# Altium project OLED.PrjPcb
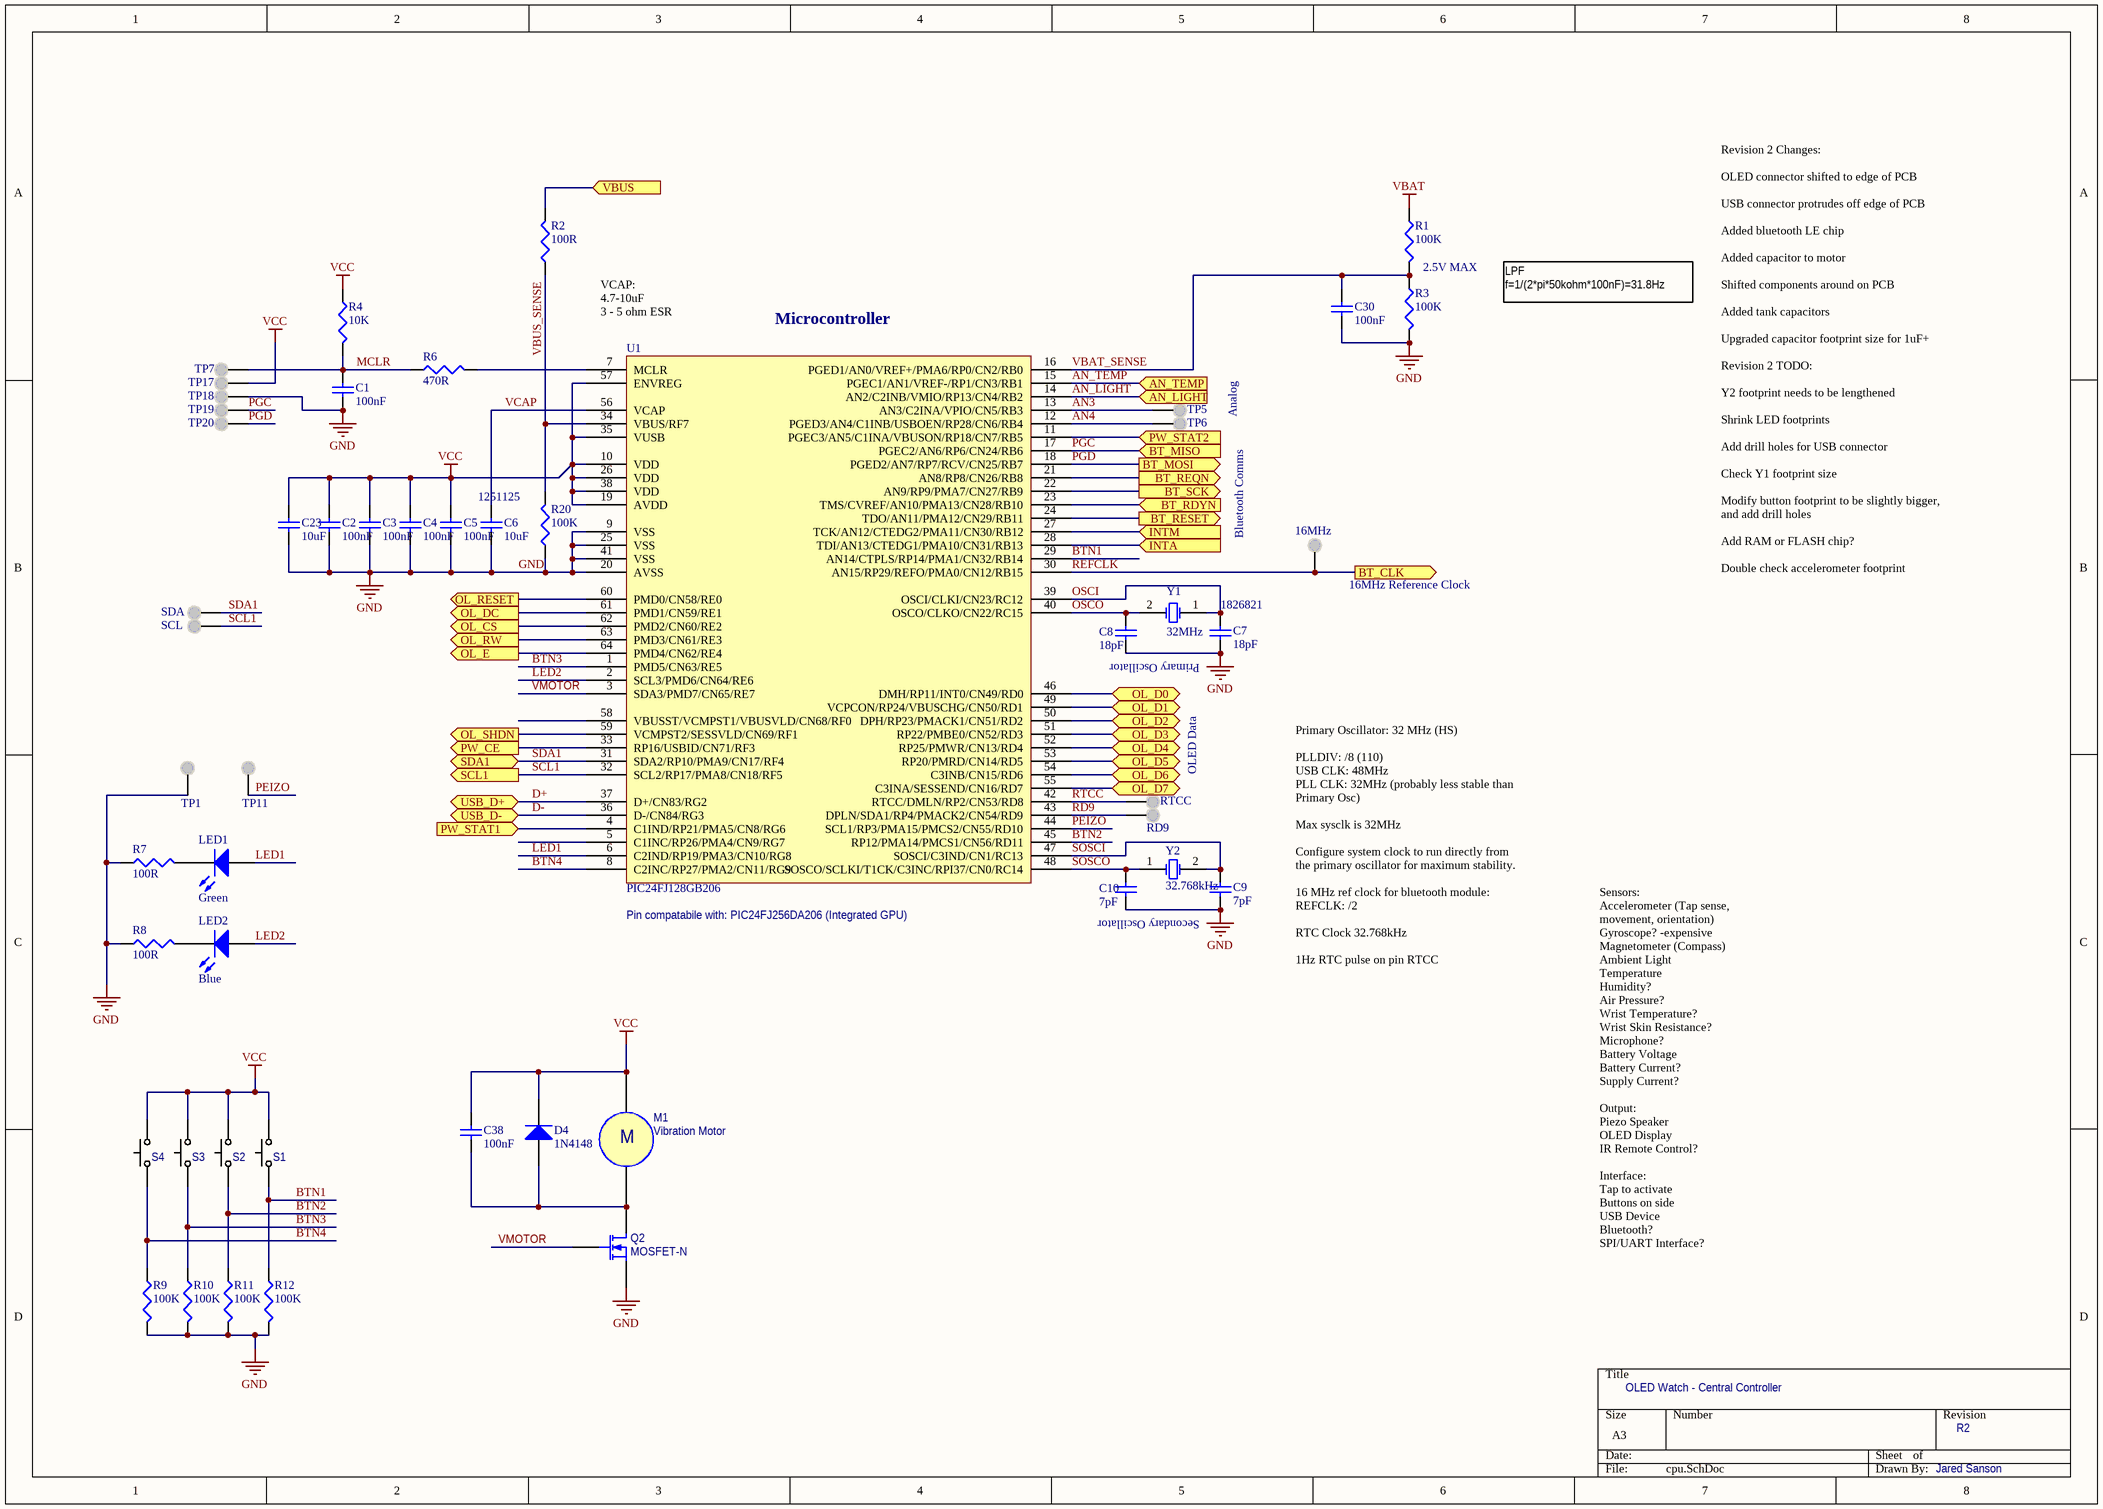
[diagram p0: cpu.SchDoc]
5 sheets, 119 parts. Net scope: flat (ports and power ports of the same name join across sheets).
Board file: pcb.PcbDoc
Sheets:
  cpu.SchDoc
  power.SchDoc
  oled.SchDoc
  sensors.SchDoc
  bluetoothle.SchDoc

## Sheet cpu.SchDoc
size A3

### Parts
C1  value 100nF  [0603C]  (hidden comment: Cap)
C2  value 100nF  [0603C]  (hidden comment: Cap)
C3  value 100nF  [0603C]  (hidden comment: Cap)
C4  value 100nF  [0603C]  (hidden comment: Cap)
C5  value 100nF  [0603C]  (hidden comment: Cap)
C6  value 10uF  Supplier Part Number 1: 1251125  [0805C]  (hidden comment: Cap)
C7  value 18pF  [0603C]  (hidden comment: Cap)
C8  value 18pF  [0603C]  (hidden comment: Cap)
C9  value 7pF  [0603C]  (hidden comment: Cap)
C10  value 7pF  [0603C]  (hidden comment: Cap)
C23  value 10uF  [0805C]  (hidden comment: Cap)
C30  value 100nF  [0603C]  (hidden comment: Cap)
C38  value 100nF  [0603C]  (hidden comment: Cap)
D4  1N4148  [0603D]
LED1  Green  [0603LED]
LED2  Blue  [0603LED]
M1  Vibration Motor  [VIBRATION_MOTOR]
OSC  16MHz  [TESTPOINT_TOP]
Q2  MOSFET-N  [SOT-23B_N]
R1  value 100K  [0603R]  (hidden comment: Res3)
R2  value 100R  [0603R]  (hidden comment: Res3)
R3  value 100K  [0603R]  (hidden comment: Res3)
R4  value 10K  [0603R]  (hidden comment: Res3)
R6  value 470R  [0603R]  (hidden comment: Res3)
R7  value 100R  [0603R]  (hidden comment: Res3)
R8  value 100R  [0603R]  (hidden comment: Res3)
R9  value 100K  [0603R]  (hidden comment: Res3)
R10  value 100K  [0603R]  (hidden comment: Res3)
R11  value 100K  [0603R]  (hidden comment: Res3)
R12  value 100K  [0603R]  (hidden comment: Res3)
R20  value 100K  [0603R]  (hidden comment: Res3)
RD9  (no value)  [TESTPOINT_TOP]
RTCC  RTCC  [TESTPOINT_TOP]  (value not drawn)
S1  SideButton  [SIDE_BUTTON]  (value not drawn)
S2  SideButton  [SIDE_BUTTON]  (value not drawn)
S3  SideButton  [SIDE_BUTTON]  (value not drawn)
S4  SideButton  [SIDE_BUTTON]  (value not drawn)
SCL  SCL  [TESTPOINT_TOP]  (value not drawn)
SDA  SDA  [TESTPOINT_TOP]  (value not drawn)
TP1  PZ-  [TESTPOINT_TOP]  (value not drawn)
TP5  AN4  [TESTPOINT_TOP]  (value not drawn)
TP6  AN5  [TESTPOINT_TOP]  (value not drawn)
TP7  MCLR  [TESTPOINT_TOP]  (value not drawn)
TP11  PZ+  [TESTPOINT_TOP]  (value not drawn)
TP17  VCC  [TESTPOINT_TOP]  (value not drawn)
TP18  GND  [TESTPOINT_TOP]  (value not drawn)
TP19  PGC  [TESTPOINT_TOP]  (value not drawn)
TP20  PGD  [TESTPOINT_TOP]  (value not drawn)
U1  PIC24FJ128GB206  [TQFP_64_10MM]
Y1  32MHz  Supplier Part Number 1: 1826821  [ABRACON32MHZ]
Y2  32.768kHz  [BCY-W2/D1.5]

### Ports
AN_LIGHT (in), AN_TEMP (in), BT_CLK (out), BT_MISO (in), BT_MOSI (out), BT_RDYN (in), BT_REQN (out), BT_RESET (out), BT_SCK (out), INTA (in), INTM (in), OL_CS (out), OL_D0 (bidir), OL_D1 (bidir), OL_D2 (bidir), OL_D3 (bidir), OL_D4 (bidir), OL_D5 (bidir), OL_D6 (bidir), OL_D7 (bidir), OL_DC (out), OL_E (out), OL_RESET (out), OL_RW (out), OL_SHDN (out), PW_CE (out), PW_STAT1 (in), PW_STAT2 (in), SCL1 (out), SDA1 (bidir), USB_D+ (bidir), USB_D- (bidir), VBUS (in)

### Nets
GND: C1.2 C2.2 C3.2 C4.2 C5.2 C6.2 C7.2 C8.2 C9.2 C10.2 C23.2 C30.2 Q2.3(S) R3.2 R7.1 R8.1 R9.2 R10.2 R11.2 R12.2 R20.1 TP1.1(TP) TP18.1(TP) U1.9(VSS) U1.20(AVSS) U1.25(VSS) U1.41(VSS)
VBAT: R1.1
VCC: C2.1 C3.1 C4.1 C5.1 C23.1 C38.1 D4.2(K) M1.1 R4.1 S1.2 S2.2 S3.2 S4.2 TP17.1(TP) U1.10(VDD) U1.19(AVDD) U1.26(VDD) U1.35(VUSB) U1.38(VDD) U1.57(ENVREG)
AN3: TP5.1(TP) U1.13(AN3/C2INA/VPIO/CN5/RB3)
AN4: TP6.1(TP) U1.12(PGED3/AN4/C1INB/USBOEN/RP28/CN6/RB4)
AN_LIGHT: U1.14(AN2/C2INB/VMIO/RP13/CN4/RB2) ; port AN_LIGHT
AN_TEMP: U1.15(PGEC1/AN1/VREF-/RP1/CN3/RB1) ; port AN_TEMP
BT_RDYN: U1.23(TMS/CVREF/AN10/PMA13/CN28/RB10) ; port BT_RDYN
BT_REQN: U1.21(AN8/RP8/CN26/RB8) ; port BT_REQN
BTN1: R12.1 S1.1 U1.29(AN14/CTPLS/RP14/PMA1/CN32/RB14)
BTN2: R11.1 S2.1 U1.45(RP12/PMA14/PMCS1/CN56/RD11)
BTN3: R10.1 S3.1 U1.1(PMD5/CN63/RE5)
BTN4: R9.1 S4.1 U1.8(C2INC/RP27/PMA2/CN11/RG9)
D+: U1.37(D+/CN83/RG2) ; port USB_D+
D-: U1.36(D-/CN84/RG3) ; port USB_D-
INTA: U1.28(TDI/AN13/CTEDG1/PMA10/CN31/RB13) ; port INTA
INTM: U1.27(TCK/AN12/CTEDG2/PMA11/CN30/RB12) ; port INTM
LED1: LED1.1(A) U1.6(C2IND/RP19/PMA3/CN10/RG8)
LED2: LED2.1(A) U1.2(SCL3/PMD6/CN64/RE6)
MCLR: C1.1 R4.2 R6.1 TP7.1(TP)
OL_CS: U1.62(PMD2/CN60/RE2) ; port OL_CS
OL_D0: U1.46(DMH/RP11/INT0/CN49/RD0) ; port OL_D0
OL_D1: U1.49(VCPCON/RP24/VBUSCHG/CN50/RD1) ; port OL_D1
OL_D2: U1.50(DPH/RP23/PMACK1/CN51/RD2) ; port OL_D2
OL_D3: U1.51(RP22/PMBE0/CN52/RD3) ; port OL_D3
OL_D4: U1.52(RP25/PMWR/CN13/RD4) ; port OL_D4
OL_D5: U1.53(RP20/PMRD/CN14/RD5) ; port OL_D5
OL_D6: U1.54(C3INB/CN15/RD6) ; port OL_D6
OL_D7: U1.55(C3INA/SESSEND/CN16/RD7) ; port OL_D7
OL_DC: U1.61(PMD1/CN59/RE1) ; port OL_DC
OL_E: U1.64(PMD4/CN62/RE4) ; port OL_E
OL_RESET: U1.60(PMD0/CN58/RE0) ; port OL_RESET
OL_RW: U1.63(PMD3/CN61/RE3) ; port OL_RW
OL_SHDN: U1.59(VCMPST2/SESSVLD/CN69/RF1) ; port OL_SHDN
OSCI: C7.1 U1.39(OSCI/CLKI/CN23/RC12) Y1.1(OSC1)
OSCO: C8.1 U1.40(OSCO/CLKO/CN22/RC15) Y1.2(OSC2)
PEIZO: TP11.1(TP) U1.44(SCL1/RP3/PMA15/PMCS2/CN55/RD10)
PGC: TP19.1(TP) U1.17(PGEC2/AN6/RP6/CN24/RB6) ; port BT_MISO
PGD: TP20.1(TP) U1.18(PGED2/AN7/RP7/RCV/CN25/RB7) ; port BT_MOSI
PW_CE: U1.33(RP16/USBID/CN71/RF3) ; port PW_CE
RD9: RD9.1(TP) U1.43(DPLN/SDA1/RP4/PMACK2/CN54/RD9)
REFCLK: OSC.1(TP) U1.30(AN15/RP29/REFO/PMA0/CN12/RB15) ; port BT_CLK
RESET: U1.24(TDO/AN11/PMA12/CN29/RB11) ; port BT_RESET
RTCC: RTCC.1(TP) U1.42(RTCC/DMLN/RP2/CN53/RD8)
SCK: U1.22(AN9/RP9/PMA7/CN27/RB9) ; port BT_SCK
SCL1: SCL.1(TP) U1.32(SCL2/RP17/PMA8/CN18/RF5) ; port SCL1
SDA1: SDA.1(TP) U1.31(SDA2/RP10/PMA9/CN17/RF4) ; port SDA1
SOSCI: C9.1 U1.47(SOSCI/C3IND/CN1/RC13) Y2.2(OSC2)
SOSCO: C10.1 U1.48(SOSCO/SCLKI/T1CK/C3INC/RPI37/CN0/RC14) Y2.1(OSC1)
STAT1: U1.4(C1IND/RP21/PMA5/CN8/RG6) ; port PW_STAT1
STAT2: U1.11(PGEC3/AN5/C1INA/VBUSON/RP18/CN7/RB5) ; port PW_STAT2
VBAT_SENSE: C30.1 R1.2 R3.1 U1.16(PGED1/AN0/VREF+/PMA6/RP0/CN2/RB0)
VBUS: R2.2 ; port VBUS
VBUS_SENSE: R2.1 R20.2 U1.34(VBUS/RF7)
VCAP: C6.1 U1.56(VCAP)
VMOTOR: Q2.2(G) U1.3(SDA3/PMD7/CN65/RE7)
NetC38_2: C38.2 D4.1(A) M1.2 Q2.1(D)
NetLED1_2: LED1.2(K) R7.2
NetLED2_2: LED2.2(K) R8.2
NetR6_2: R6.2 U1.7(MCLR)

Not connected (* = marked no-connect by the designer): U1 5(C1INC/RP26/PMA4/CN9/RG7) 58(VBUSST/VCMPST1/VBUSVLD/CN68/RF0)

### Notes on the sheet
- 2.5V MAX
- LPF
  f=1/(2*pi*50kohm*100nF)=31.8Hz
- VCAP:
  4.7-10uF
  3 - 5 ohm ESR
- (near U1) Microcontroller
- Analog
- Bluetooth Comms
- (near OSC) 16MHz Reference Clock
- Primary Oscillator
- OLED Data
- Revision 2 Changes:
  OLED connector shifted to edge of PCB
  USB connector protrudes off edge of PCB
  Added bluetooth LE chip
  Added capacitor to motor
  Shifted components around on PCB
  Added tank capacitors
  Upgraded capacitor footprint size for 1uF+
  Revision 2 TODO:
  Y2 footprint needs to be lengthened
  Shrink LED footprints
  Add drill holes for USB connector
  Check Y1 footprint size
  Modify button footprint to be slightly bigger, and add drill holes
  Add RAM or FLASH chip?
  Double check accelerometer footprint
- (near U1) Pin compatabile with: PIC24FJ256DA206 (Integrated GPU)
- Secondary Oscillator
- Primary Oscillator: 32 MHz (HS)
  PLLDIV: /8 (110)
  USB CLK: 48MHz
  PLL CLK: 32MHz (probably less stable than Primary Osc)
  Max sysclk is 32MHz
  Configure system clock to run directly from the primary oscillator for maximum stability.
  16 MHz ref clock for bluetooth module:
  REFCLK: /2
  RTC Clock 32.768kHz
  1Hz RTC pulse on pin RTCC
- Sensors:
  Accelerometer (Tap sense, movement, orientation)
  Gyroscope? -expensive
  Magnetometer (Compass)
  Ambient Light
  Temperature
  Humidity?
  Air Pressure?
  Wrist Temperature?
  Wrist Skin Resistance?
  Microphone?
  Battery Voltage
  Battery Current?
  Supply Current?
  Output:
  Piezo Speaker
  OLED Display
  IR Remote Control?
  Interface:
  Tap to activate
  Buttons on side
  USB Device
  Bluetooth?
  SPI/UART Interface?
- OLED Watch - Central Controller
- R2
- Jared Sanson
- (in symbol VibrationMotor) M

### Library data of the parts
C1-C10 C23 C30 C38 = Cap: Capacitor; Published: 8-Jun-2000; LatestRevisionDate: 17-Jul-2002; LatestRevisionNote: Re-released for DXP Platform.; PackageReference: RAD-0.3; Publisher: Altium Limited; PackageDescription: Radial Cap, Thru-Hole; 2 Leads; 0.3 in Pin Spacing
  C6: Supplier 1: Farnell
D4 = Diode: Default Diode; Published: 8-Jun-2000; LatestRevisionDate: 17-Jul-2002; LatestRevisionNote: Re-released for DXP Platform.; PackageVersion: Sep-1996; PackageReference: SMC; Publisher: Altium Limited; PackageDescription: DO-214-AB/SMC; 2 C-Bend Leads; Body 7.9 x 5.9 mm, inc. leads (LxW); Code_JEDEC: DO-214-AB
LED1 LED2 = LED2: Typical RED, GREEN, YELLOW, AMBER GaAs LED; Published: 8-Jun-2000; LatestRevisionDate: 17-Jul-2002; LatestRevisionNote: Re-released for DXP Platform.; PackageVersion: Feb-2002; PackageReference: 3.2X1.6X1.1; Publisher: Altium Limited; PackageDescription: SM LED; 2 Flat Leads
M1 = VibrationMotor
OSC RD9 RTCC SCL SDA TP1 TP5-TP7 TP11 TP17-TP20 = TestPoint: Test Point; Comment_1: *
Q2 = MOSFET-N: N-Channel MOSFET; Published: 8-Jun-2000; LatestRevisionDate: 17-Jul-2002; LatestRevisionNote: Re-released for DXP Platform.; PackageVersion: 1995/1996; PackageReference: E3; Publisher: Altium Limited; PackageDescription: TO, Flat Index; 3 In-Line, Axial Leads; Body Dia. 4.6mm; Lead Dia. 0.5 mm (max)
R1-R4 R6-R12 R20 = Res3: Resistor; Published: 8-Jun-2000; LatestRevisionDate: 29-May-2009; LatestRevisionNote: IPC-7351 Footprint Added.; PackageReference: J1-0603; Publisher: Altium Limited; PackageDescription: Chip Resistor
Y1 = XTAL: Crystal Oscillator; Manufacturer: ABRACON; Manufacturer Part Number: ABM3-32.000MHZ-D2Y-T; Description: ABRACON - ABM3-32.000MHZ-D2Y-T - CRYSTAL, 32MHZ, 18PF, SMD; Published: 8-Jun-2000; LatestRevisionDate: 17-Jul-2002; LatestRevisionNote: Re-released for DXP Platform.; PackageReference: R38; Publisher: Altium Limited; PackageDescription: Crystal, Thru-Hole; 2 Leads; Body 3.1 x 8.2 mm (Dia.xH); Supplier 1: Farnell; RoHS: Y-EX; Stock 1: 728; Pricing 1: 1=2.88, 10=2.25, 50=1.75, 100=1.26, 500=1.02 (NZD); ComponentLink1URL: http://www.abracon.com/Resonators/abm3.pdf; ComponentLink1Description: http://www.abracon.com/Resonators/abm3.pdf
Y2 = XTAL: Crystal Oscillator; Published: 8-Jun-2000; LatestRevisionDate: 17-Jul-2002; LatestRevisionNote: Re-released for DXP Platform.; PackageReference: R38; Publisher: Altium Limited; PackageDescription: Crystal, Thru-Hole; 2 Leads; Body 3.1 x 8.2 mm (Dia.xH)

## Sheet power.SchDoc
size A4
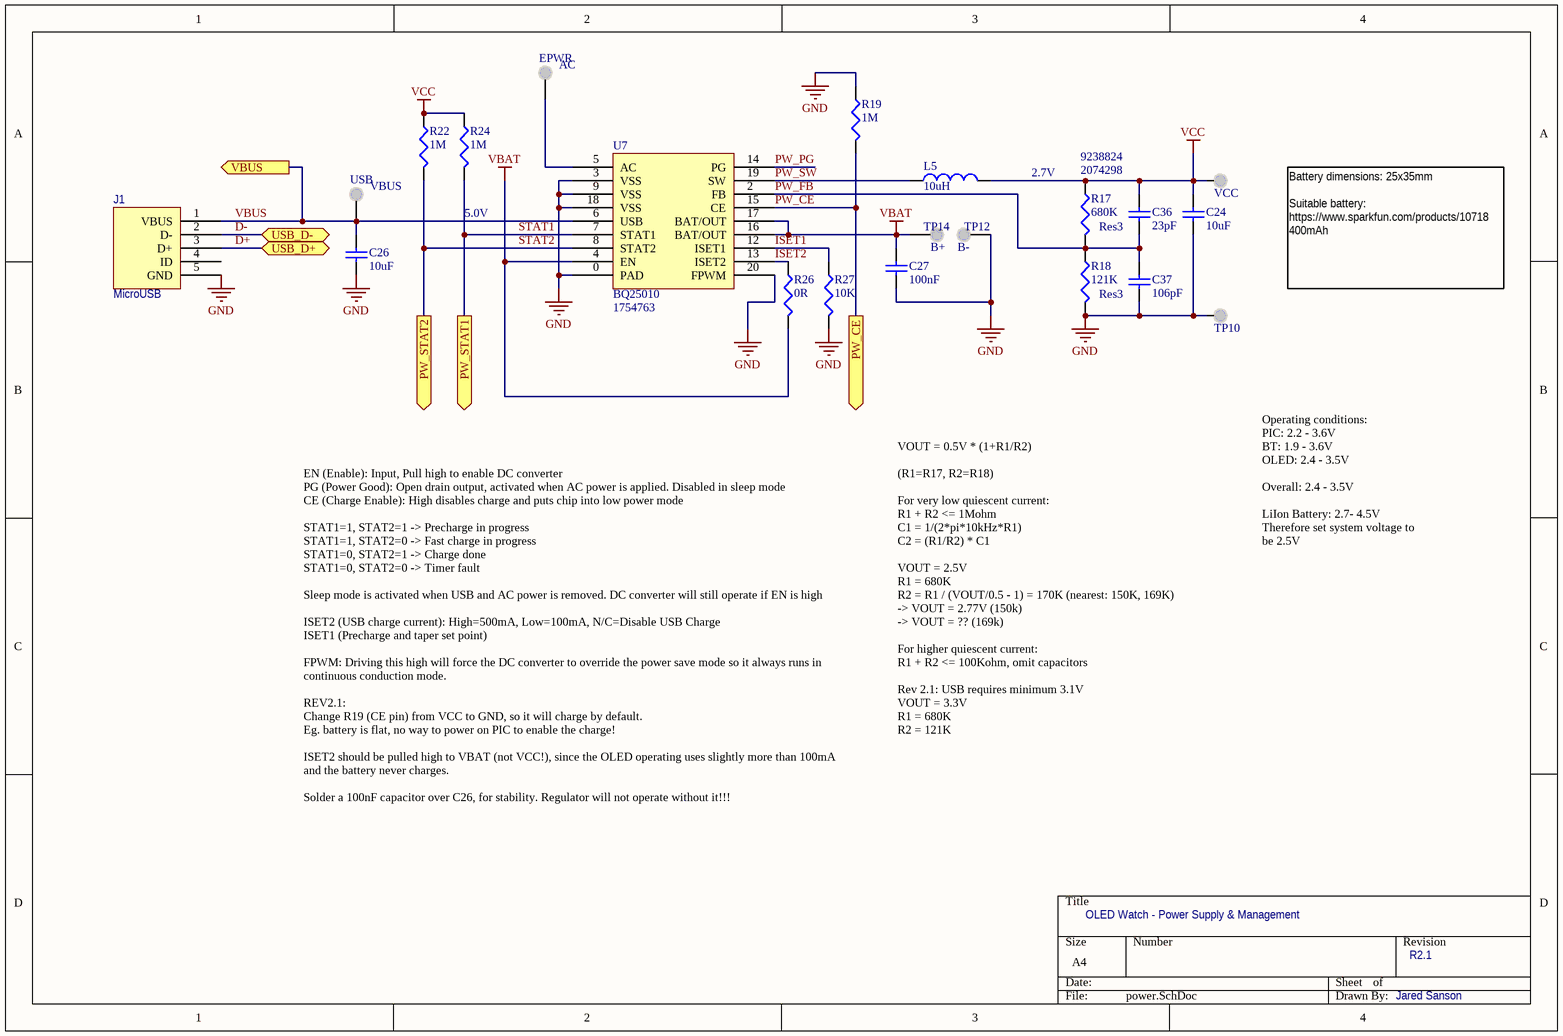
[diagram p1: power.SchDoc]

### Parts
C24  value 10uF  [0805C]  (hidden comment: Cap)
C26  value 10uF  [0805C]  (hidden comment: Cap)
C27  value 100nF  [0603C]  (hidden comment: Cap)
C36  value 23pF  [0603C]  (hidden comment: Cap)
C37  value 106pF  [0603C]  (hidden comment: Cap)
EPWR  AC  [TESTPOINT_TOP]
J1  MicroUSB  [MICRO_USB]
L5  value 10uH  [INDC3225N]  (hidden comment: Inductor)
R17  Res3  value 680K  Supplier Part Number 1: 2074298  Supplier Part Number 2: 9238824  [0603R]
R18  Res3  value 121K  [0603R]
R19  value 1M  [0603R]  (hidden comment: Res3)
R22  value 1M  [0603R]  (hidden comment: Res3)
R24  value 1M  [0603R]  (hidden comment: Res3)
R26  value 0R  [0603R]  (hidden comment: Res3)
R27  value 10K  [0603R]  (hidden comment: Res3)
TP10  GND  [TESTPOINT_TOP]  (value not drawn)
TP12  B-  [TESTPOINT_TOP]
TP14  B+  [TESTPOINT_TOP]
U7  BQ25010  Supplier Part Number 1: 1754763  [RHL]
USB  VBUS  [TESTPOINT_TOP]
VCC  VCC  [TESTPOINT_TOP]  (value not drawn)

### Ports
PW_CE (out), PW_STAT1 (out), PW_STAT2 (out), USB_D+ (bidir), USB_D- (bidir), VBUS (out)

### Nets
GND: C24.2 C26.2 C27.2 C37.2 J1.5(GND) R18.2 R19.1 R27.2 TP10.1(TP) TP12.1(TP) U7.0(PAD) U7.3(VSS) U7.9(VSS) U7.18(VSS) U7.20(FPWM)
VBAT: C27.1 R26.2 TP14.1(TP) U7.4(EN) U7.16(BAT/OUT) U7.17(BAT/OUT)
VCC: C24.1 C36.1 L5.2 R17.1 R22.1 R24.1 VCC.1(TP)
D+: J1.3(D+) ; port USB_D+
D-: J1.2(D-) ; port USB_D-
ISET1: R27.1 U7.12(ISET1)
ISET2: R26.1 U7.13(ISET2)
PW_CE: R19.2 U7.15(CE) ; port PW_CE
PW_FB: C36.2 C37.1 R17.2 R18.1 U7.2(FB)
PW_PG: U7.14(PG)
PW_SW: L5.1 U7.19(SW)
STAT1: R24.2 U7.7(STAT1) ; port PW_STAT1
STAT2: R22.2 U7.8(STAT2) ; port PW_STAT2
VBUS: C26.1 J1.1(VBUS) U7.6(USB) USB.1(TP) ; port VBUS
NetEPWR_1: EPWR.1(TP) U7.5(AC)

Not connected (* = marked no-connect by the designer): J1 4(ID)

### Notes on the sheet
- (near R17) 2.7V
- 5.0V
- Battery dimensions: 25x35mm
  Suitable battery:
  https://www.sparkfun.com/products/10718
  400mAh
- Operating conditions:
  PIC: 2.2 - 3.6V
  BT: 1.9 - 3.6V
  OLED: 2.4 - 3.5V
  Overall: 2.4 - 3.5V
  LiIon Battery: 2.7- 4.5V
  Therefore set system voltage to be 2.5V
- VOUT = 0.5V * (1+R1/R2)
  (R1=R17, R2=R18)
  For very low quiescent current:
  R1 + R2 <= 1Mohm
  C1 = 1/(2*pi*10kHz*R1)
  C2 = (R1/R2) * C1
  VOUT = 2.5V
  R1 = 680K
  R2 = R1 / (VOUT/0.5 - 1) = 170K (nearest: 150K, 169K)
  -> VOUT = 2.77V (150k)
  -> VOUT = ?? (169k)
  For higher quiescent current:
  R1 + R2 <= 100Kohm, omit capacitors
  Rev 2.1: USB requires minimum 3.1V
  VOUT = 3.3V
  R1 = 680K
  R2 = 121K
- EN (Enable): Input, Pull high to enable DC converter
  PG (Power Good): Open drain output, activated when AC power is applied. Disabled in sleep mode
  CE (Charge Enable): High disables charge and puts chip into low power mode
  STAT1=1, STAT2=1 -> Precharge in progress
  STAT1=1, STAT2=0 -> Fast charge in progress
  STAT1=0, STAT2=1 -> Charge done
  STAT1=0, STAT2=0 -> Timer fault
  Sleep mode is activated when USB and AC power is removed. DC converter will still operate if EN is high
  ISET2 (USB charge current): High=500mA, Low=100mA, N/C=Disable USB Charge
  ISET1 (Precharge and taper set point)
  FPWM: Driving this high will force the DC converter to override the power save mode so it always runs in continuous conduction mode.
  REV2.1:
  Change R19 (CE pin) from VCC to GND, so it will charge by default.
  Eg. battery is flat, no way to power on PIC to enable the charge!
  ISET2 should be pulled high to VBAT (not VCC!), since the OLED operating uses slightly more than 100mA and the battery never charges.
  Solder a 100nF capacitor over C26, for stability. Regulator will not operate without it!!!
- OLED Watch - Power Supply & Management
- R2.1
- Jared Sanson

### Library data of the parts
C24 C26 C27 C36 C37 = Cap: Capacitor; Published: 8-Jun-2000; LatestRevisionDate: 17-Jul-2002; LatestRevisionNote: Re-released for DXP Platform.; PackageReference: RAD-0.3; Publisher: Altium Limited; PackageDescription: Radial Cap, Thru-Hole; 2 Leads; 0.3 in Pin Spacing
EPWR TP10 TP12 TP14 USB VCC = TestPoint: Test Point; Comment_1: *
L5 = Inductor: Code_IEC: 1005; Published: 8-Jun-2000; LatestRevisionDate: 29-May-2009; LatestRevisionNote: IPC-7351 Footprint Added.; PackageReference: 0402-A; Publisher: Altium Limited; PackageDescription: Chip Inductor; Code_JEITA: 0402
R17-R19 R22 R24 R26 R27 = Res3: Resistor; Published: 8-Jun-2000; LatestRevisionDate: 29-May-2009; LatestRevisionNote: IPC-7351 Footprint Added.; PackageReference: J1-0603; Publisher: Altium Limited; PackageDescription: Chip Resistor
  R17 R18: Supplier 1: Farnell; Supplier 2: Farnell
U7 = BQ25010: Supplier 1: Farnell

## Sheet oled.SchDoc
size A4
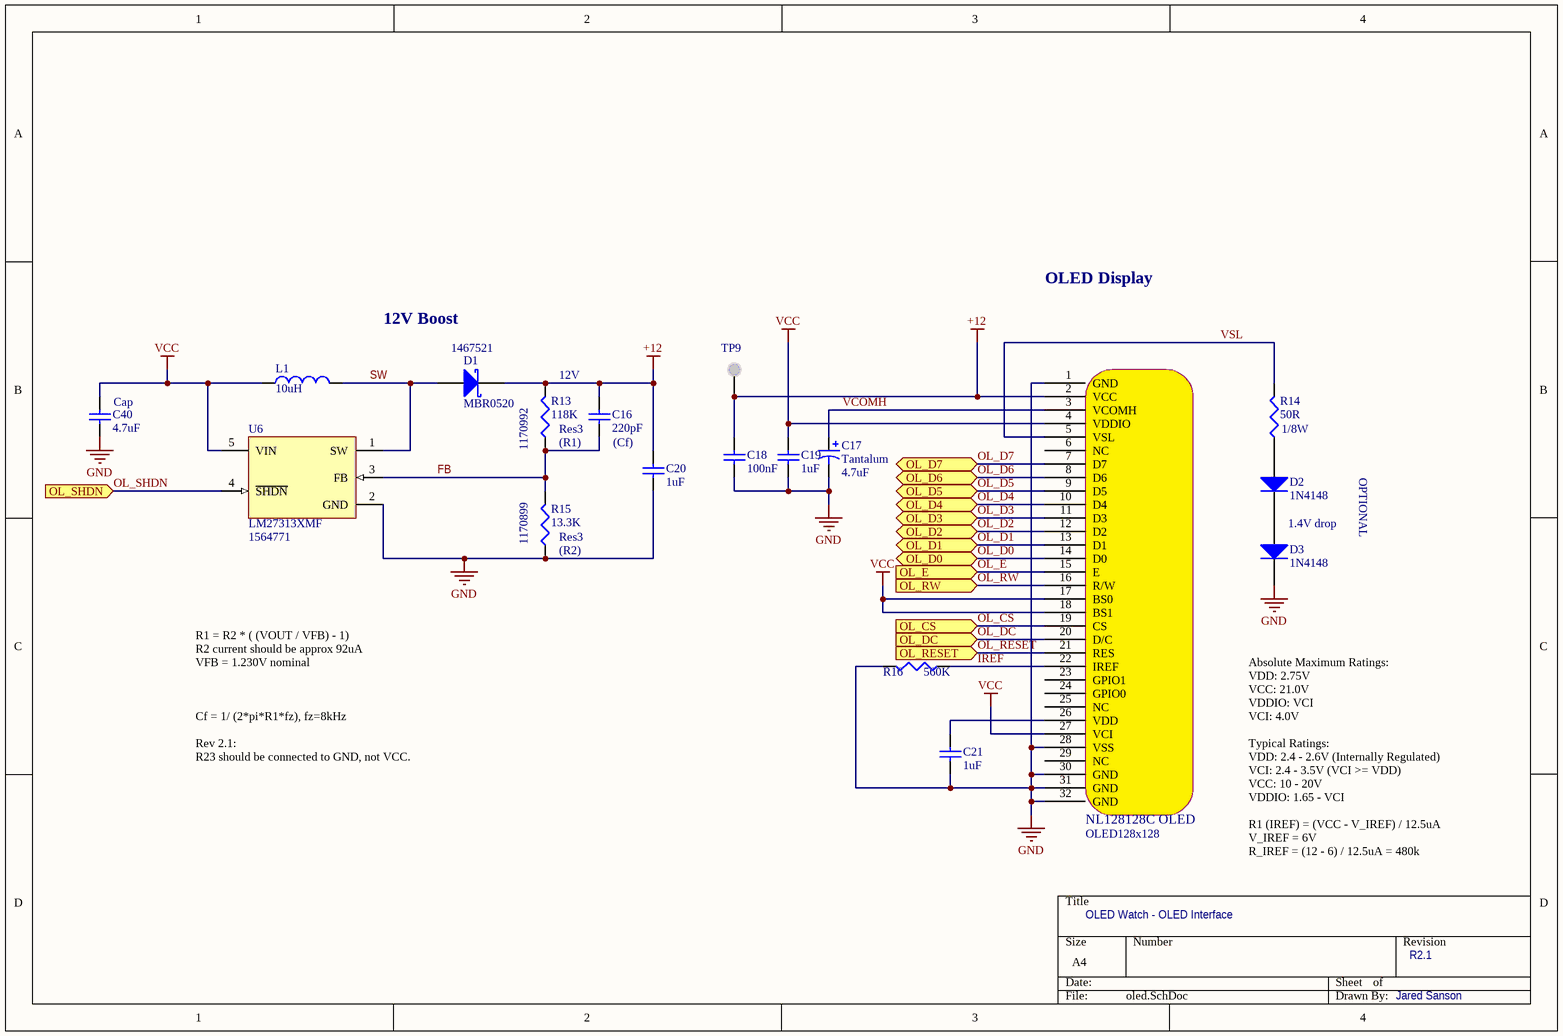
[diagram p2: oled.SchDoc]

### Parts
C16  value 220pF  Variable: (Cf)  [0603C]  (hidden comment: Cap)
C17  Tantalum  value 4.7uF  [0805C]
C18  value 100nF  [0603C]  (hidden comment: Cap)
C19  value 1uF  [0603C]  (hidden comment: Cap)
C20  value 1uF  [0805C]  (hidden comment: Cap)
C21  value 1uF  [0805C]  (hidden comment: Cap)
C40  Cap  value 4.7uF  [0805C]
D1  MBR0520  Supplier Part Number 1: 1467521  [0603D]
D2  1N4148  [0603D]
D3  1N4148  [0603D]
L1  value 10uH  [INDC3225N]  (hidden comment: Inductor)
OLED128x128  OLED128x128  [OLED128X128]  (value not drawn)
R13  Res3  value 118K  Variable: (R1)  Supplier Part Number 1: 1170992  [0603R]
R14  value 50R  [0603R]  (hidden comment: Res3)
R15  Res3  value 13.3K  Variable: (R2)  Supplier Part Number 1: 1170899  [0603R]
R16  value 560K  [0603R]  (hidden comment: Res3)
TP9  +12  [TESTPOINT_TOP]  (value not drawn)
U6  LM27313XMF  Supplier Part Number 1: 1564771  [MF05A_N]

### Ports
OL_CS (in), OL_D0 (bidir), OL_D1 (bidir), OL_D2 (bidir), OL_D3 (bidir), OL_D4 (bidir), OL_D5 (bidir), OL_D6 (bidir), OL_D7 (bidir), OL_DC (in), OL_E (in), OL_RESET (in), OL_RW (in), OL_SHDN (in)

### Nets
+12: C16.1 C18.1 C20.1 D1.2(K) OLED128x128.2(VCC) R13.2 TP9.1(TP)
GND: C17.2 C18.2 C19.2 C20.2 C21.2 C40.2 D3.2(K) OLED128x128.1(GND) OLED128x128.28(VSS) OLED128x128.30(GND) OLED128x128.31(GND) OLED128x128.32(GND) R15.1 R16.2 U6.2(GND)
VCC: C19.1 C40.1 L1.1 OLED128x128.4(VDDIO) OLED128x128.17(BS0) OLED128x128.18(BS1) OLED128x128.27(VCI) U6.5(VIN)
FB: C16.2 R13.1 R15.2 U6.3(FB)
IREF: OLED128x128.22(IREF) R16.1
OL_CS: OLED128x128.19(CS) ; port OL_CS
OL_D0: OLED128x128.14(D0) ; port OL_D0
OL_D1: OLED128x128.13(D1) ; port OL_D1
OL_D2: OLED128x128.12(D2) ; port OL_D2
OL_D3: OLED128x128.11(D3) ; port OL_D3
OL_D4: OLED128x128.10(D4) ; port OL_D4
OL_D5: OLED128x128.9(D5) ; port OL_D5
OL_D6: OLED128x128.8(D6) ; port OL_D6
OL_D7: OLED128x128.7(D7) ; port OL_D7
OL_DC: OLED128x128.20(D/C) ; port OL_DC
OL_E: OLED128x128.15(E) ; port OL_E
OL_RESET: OLED128x128.21(RES) ; port OL_RESET
OL_RW: OLED128x128.16(R/W) ; port OL_RW
OL_SHDN: U6.4(~{SHDN}) ; port OL_SHDN
SW: D1.1(A) L1.2 U6.1(SW)
VCOMH: C17.1 OLED128x128.3(VCOMH)
VSL: OLED128x128.5(VSL) R14.2
NetC21_1: C21.1 OLED128x128.26(VDD)
NetD2_1: D2.1(A) R14.1
NetD2_2: D2.2(K) D3.1(A)

Not connected (* = marked no-connect by the designer): OLED128x128 6(NC) 23(GPIO1) 24(GPIO0) 25(NC) 29(NC)

### Notes on the sheet
- OLED Display
- 12V Boost
- (near R13) 12V
- (near R14) 1/8W
- OPTIONAL
- 1.4V drop
- R1 = R2 * ( (VOUT / VFB) - 1)
  R2 current should be approx 92uA
  VFB = 1.230V nominal
  Cf = 1/ (2*pi*R1*fz), fz=8kHz
  Rev 2.1:
  R23 should be connected to GND, not VCC.
- OLED Watch - OLED Interface
- Absolute Maximum Ratings:
  VDD: 2.75V
  VCC: 21.0V
  VDDIO: VCI
  VCI: 4.0V
  Typical Ratings:
  VDD: 2.4 - 2.6V (Internally Regulated)
  VCI: 2.4 - 3.5V (VCI >= VDD)
  VCC: 10 - 20V
  VDDIO: 1.65 - VCI
  R1 (IREF) = (VCC - V_IREF) / 12.5uA
  V_IREF = 6V
  R_IREF = (12 - 6) / 12.5uA = 480k
- R2.1
- Jared Sanson
- (in symbol O) NL128128C OLED

### Library data of the parts
C16 C18-C21 C40 = Cap: Capacitor; Published: 8-Jun-2000; LatestRevisionDate: 17-Jul-2002; LatestRevisionNote: Re-released for DXP Platform.; PackageReference: RAD-0.3; Publisher: Altium Limited; PackageDescription: Radial Cap, Thru-Hole; 2 Leads; 0.3 in Pin Spacing
C17 = Cap Pol1: Polarized Capacitor (Radial); Published: 8-Jun-2000; LatestRevisionDate: 17-Jul-2002; LatestRevisionNote: Re-released for DXP Platform.; PackageReference: RB7.6-15; Publisher: Altium Limited; PackageDescription: Polarized Capacitor (Radial); 2 Leads
D1 = D Schottky: Schottky Diode; Published: 8-Jun-2000; LatestRevisionDate: 17-Jul-2002; LatestRevisionNote: Re-released for DXP Platform.; PackageReference: SMB; Publisher: Altium Limited; PackageDescription: DO-214-AA/SMB; 2 C-Bend Leads; Body 5.3 x 3.6 mm, inc. leads (LxW); Code_JEDEC: DO-214-AA; Supplier 1: Farnell
D2 D3 = Diode: Default Diode; Published: 8-Jun-2000; LatestRevisionDate: 17-Jul-2002; LatestRevisionNote: Re-released for DXP Platform.; PackageVersion: Sep-1996; PackageReference: SMC; Publisher: Altium Limited; PackageDescription: DO-214-AB/SMC; 2 C-Bend Leads; Body 7.9 x 5.9 mm, inc. leads (LxW); Code_JEDEC: DO-214-AB
L1 = Inductor: Code_IEC: 1005; Published: 8-Jun-2000; LatestRevisionDate: 29-May-2009; LatestRevisionNote: IPC-7351 Footprint Added.; PackageReference: 0402-A; Publisher: Altium Limited; PackageDescription: Chip Inductor; Code_JEITA: 0402
OLED128x128 = O: OLED
R13-R16 = Res3: Resistor; Published: 8-Jun-2000; LatestRevisionDate: 29-May-2009; LatestRevisionNote: IPC-7351 Footprint Added.; PackageReference: J1-0603; Publisher: Altium Limited; PackageDescription: Chip Resistor
  R13 R15: Supplier 1: Farnell
TP9 = TestPoint: Test Point; Comment_1: *
U6 = LM27313XMF: 1.6 MHz Boost Converter With 30V Internal FET Switch in SOT-23; Manufacturer: National Semiconductor; CompType: Switcher; PackageTopMarking: SRPB*XTT; PowerWise: N; FirstPublished: 4-Dec-2008; DatasheetVersion: Jul-2007; PackageVersion: revD, Aug-2008; PackageReference: MF05A; Publisher: Altium Limited; PackageDescription: Molded SOT-23, .115 x .063 x .040 in Body, 5 Lead, .0375 in Pitch; PartNumber: LM27313XMF; RoHS: O; PinCount: 5; DigiKeyPartNumber: LM27313XMFCT-ND; ComponentLink1Description: LM27313 Datasheet; ComponentLink1URL: http://www.national.com/ds/LM/LM27313.pdf; ComponentLink2Description: LM27313 Web Page; ComponentLink2URL: http://www.national.com/pf/LM/LM27313.html; ComponentLink3Description: MF05A Package Page; ComponentLink3URL: http://www.national.com/packaging/folders/mf05a.html; Supplier 1: Farnell

## Sheet sensors.SchDoc
size A4
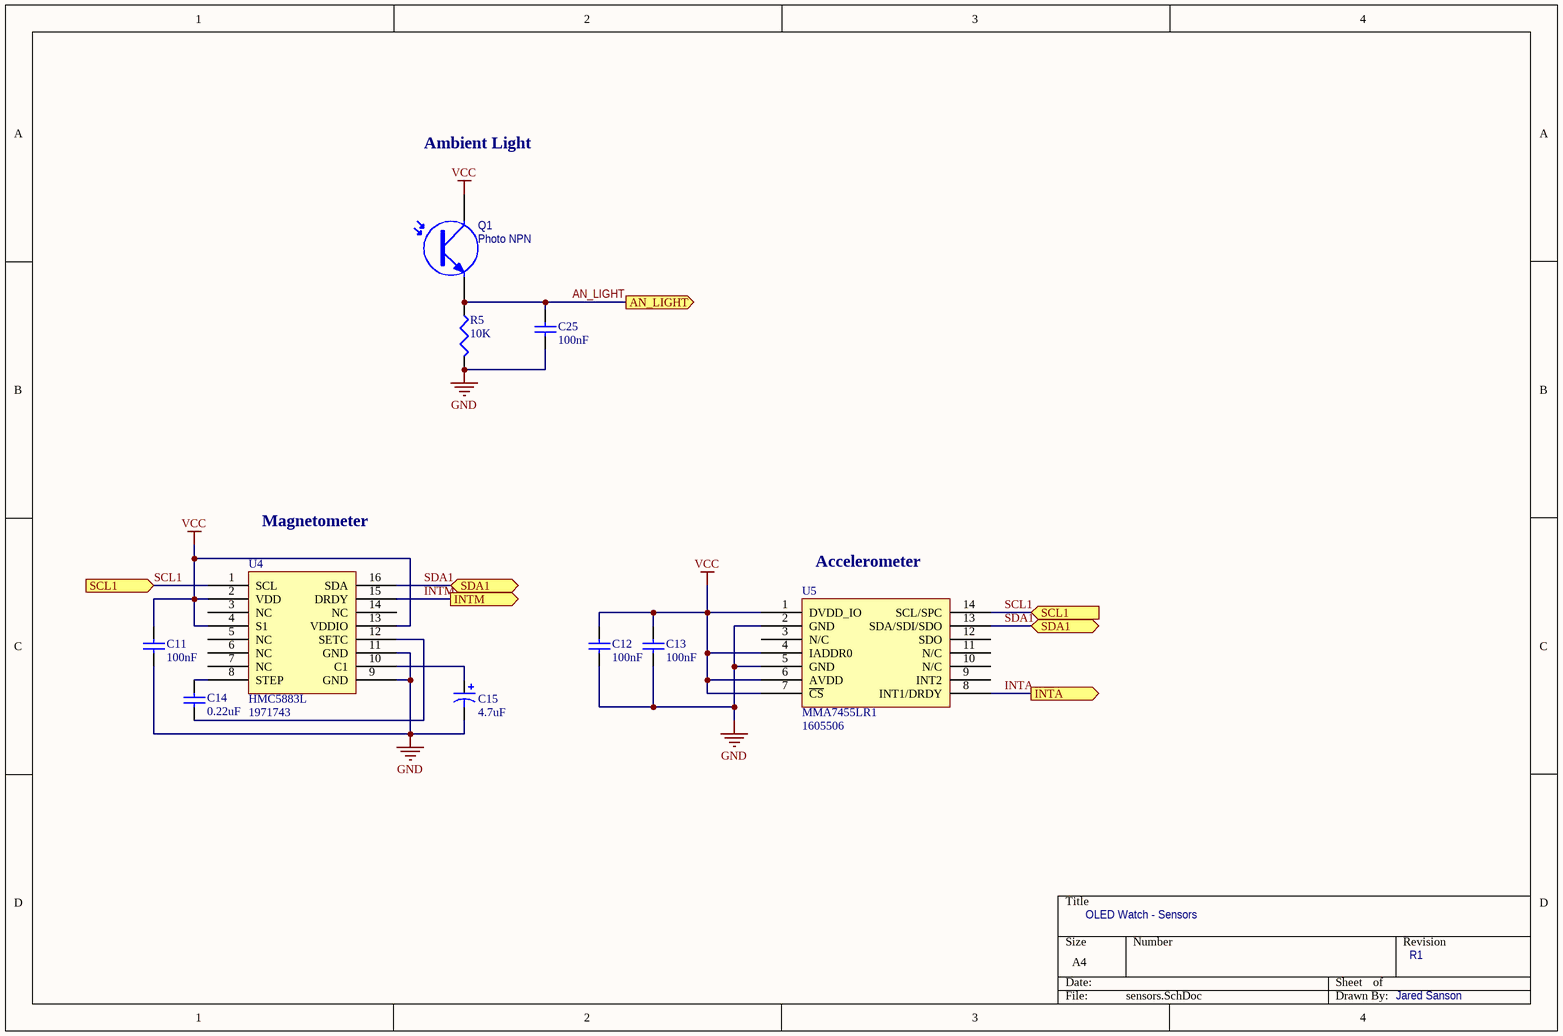
[diagram p3: sensors.SchDoc]

### Parts
C11  value 100nF  [0603C]  (hidden comment: Cap)
C12  value 100nF  [0603C]  (hidden comment: Cap)
C13  value 100nF  [0603C]  (hidden comment: Cap)
C14  value 0.22uF  [0603C]  (hidden comment: Cap)
C15  value 4.7uF  [0805C]  (hidden comment: Cap Pol1)
C25  value 100nF  [0603C]  (hidden comment: Cap)
Q1  Photo NPN  [TEMT6000]
R5  value 10K  [0603R]  (hidden comment: Res3)
U4  HMC5883L  Supplier Part Number 1: 1971743  [HMC5883L_16PINQFN]
U5  MMA7455LR1  Supplier Part Number 1: 1605506  [LGA80P500X300-14N]

### Ports
AN_LIGHT (out), INTA (out), INTM (out), SCL1 (in), SDA1 (bidir)

### Nets
GND: C11.2 C12.2 C13.2 C15.2 C25.2 R5.2 U4.9(GND) U4.11(GND) U5.2(GND) U5.5(GND)
VCC: C11.1 C12.1 C13.1 Q1.1(C) U4.2(VDD) U4.4(S1) U4.13(VDDIO) U5.1(DVDD_IO) U5.4(IADDR0) U5.6(AVDD) U5.7(~{CS})
AN_LIGHT: C25.1 Q1.3(E) R5.1 ; port AN_LIGHT
INTA: U5.8(INT1/DRDY) ; port INTA
INTM: U4.15(DRDY) ; port INTM
SCL1: U4.1(SCL) U5.14(SCL/SPC) ; port SCL1
SDA1: U4.16(SDA) U5.13(SDA/SDI/SDO) ; port SDA1
NetC14_1: C14.1 U4.12(SETC)
NetC14_2: C14.2 U4.8(STEP)
NetC15_1: C15.1 U4.10(C1)

Not connected (* = marked no-connect by the designer): U4 3(NC) 5(NC) 6(NC) 7(NC) 14(NC); U5 3(N/C) 9(INT2) 10(N/C) 11(N/C) 12(SDO)

### Notes on the sheet
- Ambient Light
- Magnetometer
- (near U5) Accelerometer
- OLED Watch - Sensors
- R1
- Jared Sanson

### Library data of the parts
C11-C14 C25 = Cap: Capacitor; Published: 8-Jun-2000; LatestRevisionDate: 17-Jul-2002; LatestRevisionNote: Re-released for DXP Platform.; PackageReference: RAD-0.3; Publisher: Altium Limited; PackageDescription: Radial Cap, Thru-Hole; 2 Leads; 0.3 in Pin Spacing
C15 = Cap Pol1: Polarized Capacitor (Radial); Published: 8-Jun-2000; LatestRevisionDate: 17-Jul-2002; LatestRevisionNote: Re-released for DXP Platform.; PackageReference: RB7.6-15; Publisher: Altium Limited; PackageDescription: Polarized Capacitor (Radial); 2 Leads
Q1 = Photo NPN: NPN Phototransistor; Published: 24-Mar-1999; LatestRevisionDate: 17-Jul-2002; LatestRevisionNote: Re-released for DXP Platform.; PackageReference: TO-220_A; Publisher: Altium Limited; Code_JEDEC: TO-220-AC
R5 = Res3: Resistor; Published: 8-Jun-2000; LatestRevisionDate: 29-May-2009; LatestRevisionNote: IPC-7351 Footprint Added.; PackageReference: J1-0603; Publisher: Altium Limited; PackageDescription: Chip Resistor
U4 = HMC5883L: Honeywell 3 Axis Magnetometer; Manufacturer: HONEYWELL M&PS; Manufacturer Part Number: HMC5883L-TR; Description: HONEYWELL M&PS - HMC5883L-TR - SENSOR, MAGNETIC, 3AXIS, 16 PIN; Magnetic Field Min: -8; Magnetic Field Max: 8; Resolution (Gauss): 0.005; Interface Type: I2; Magnetometer Range: -8G to 8; Supply Voltage Range: 2.16V DC to 3.6; Supplier 1: Farnell; RoHS: YES; Stock 1: 526; Pricing 1: 1=3.61, 5=3.43, 10=3.28, 25=3.09 (NZD); Operating Temperature Max: 85; Operating Temperature Min: -30; Operating Temperature Range: -30°C to +85; ComponentLink1URL: http://www.farnell.com/datasheets/1683374.pdf; ComponentLink1Description: http://www.farnell.com/datasheets/1683374.pdf
U5 = MMA7455LR1: 3-Axis Accelerometer, 5g; Manufacturer: FREESCALE SEMICONDUCTOR; Description: FREESCALE SEMICONDUCTOR - MMA7455LR1 - IC, 3-AXIS DIGITAL 2, 4, 8G, 14-LGA; MEMS Sensor Output: Digital; Measurement Axis: X, Y, Z; Acceleration Range: ± 2g, ± 4g, ± 8; Supply Voltage Min: 2.4; Supply Voltage Max: 3.6; Sensor Case Style: LGA; No. of Pins: 14; Sensitivity Min: 58counts/g, 29counts/g, 14.5; Sensitivity Typ: 16counts/g, 32counts/g, 64; Sensitivity Max: 70counts/g, 35counts/g, 17.5; SVHC: No SVHC (19-Dec-2012); Amplifier Type: Accelerometer Sensor X-Y-Z axis; Interface Type: I2; No. of Bits: 10; No. of Channels: 3; Supply Current: 400; Supply Voltage Range: 2.4V to 3.6; Supplier 1: Farnell; Manufacturer Part Number: MMA7455LR1; RoHS: YES; Stock 1: 19; Pricing 1: 1=4.24, 25=4.19, 100=4.11, 1000=3.67 (NZD); MSL: MSL 3 - 168 hours; Operating Temperature Max: 85; Operating Temperature Min: -40; Operating Temperature Range: -40°C to +85; Package / Case: LGA; Supply Voltage DC Max: 3.6; Supply Voltage DC Min: 2.4; Termination Type: SMD; ComponentLink1URL: http://www.freescale.com/files/sensors/doc/data_sheet/MMA7455L.pdf; ComponentLink1Description: http://www.freescale.com/files/sensors/doc/data_sheet/MMA7455L.pdf

## Sheet bluetoothle.SchDoc
size A4
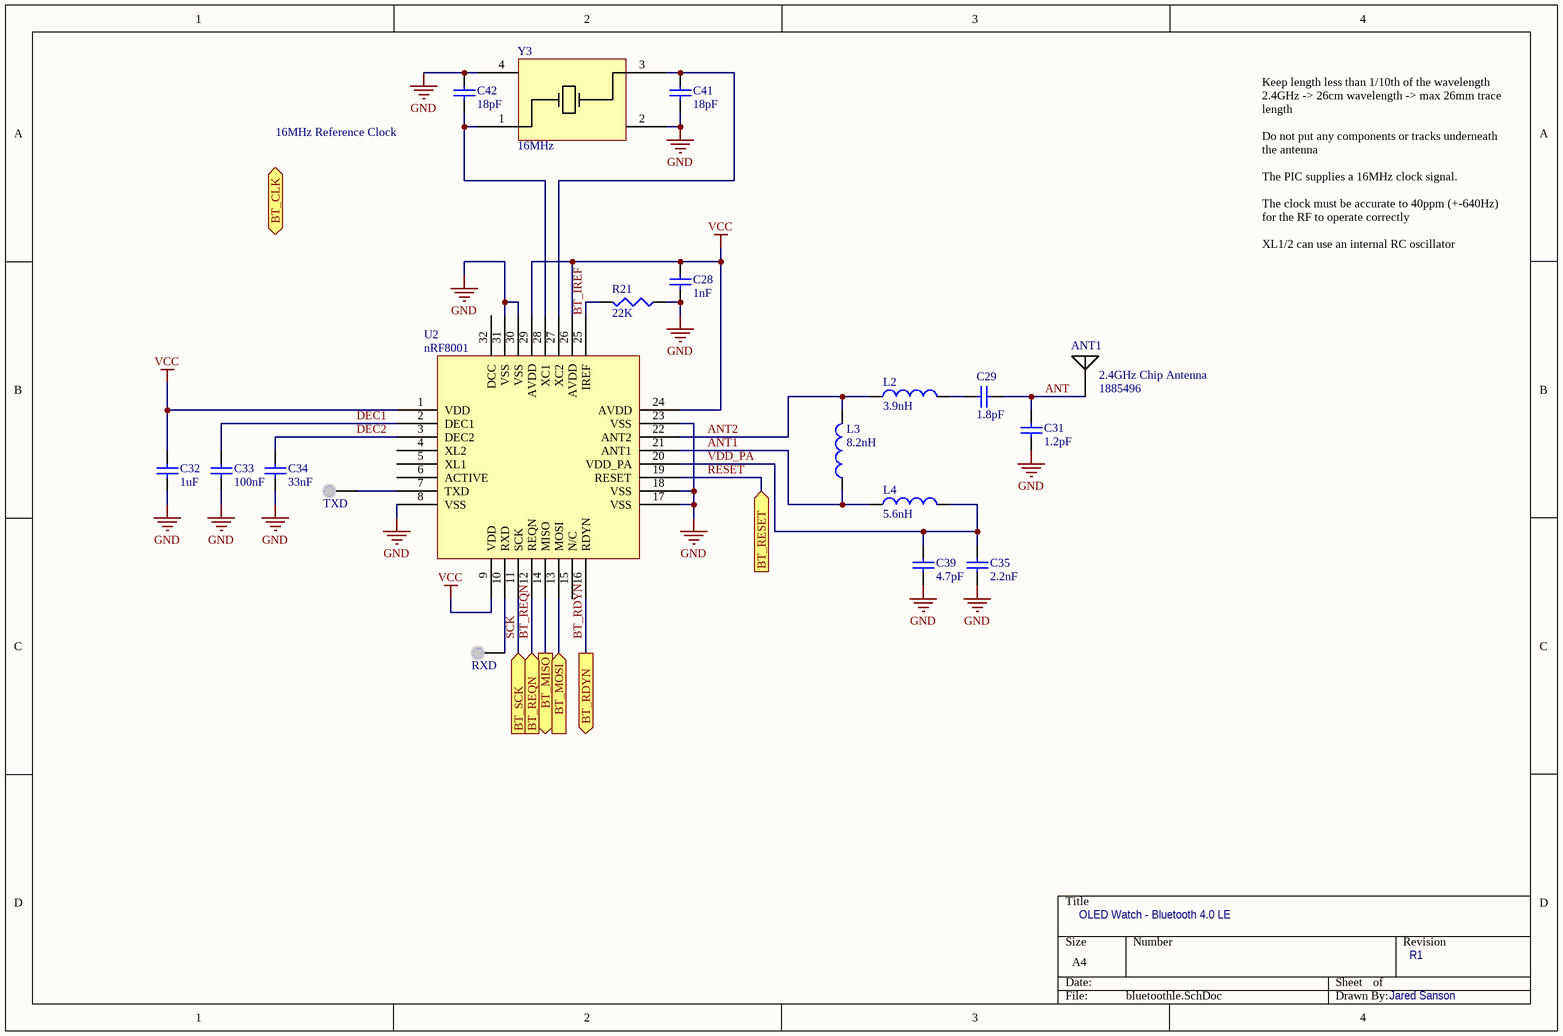
[diagram p4: bluetoothle.SchDoc]

### Parts
ANT1  2.4GHz Chip Antenna  Supplier Part Number 1: 1885496  [2450AT18A100E]
C28  value 1nF  [0603C]  (hidden comment: Cap)
C29  value 1.8pF  [0603C]  (hidden comment: Cap)
C31  value 1.2pF  [0603C]  (hidden comment: Cap)
C32  value 1uF  [0805C]  (hidden comment: Cap)
C33  value 100nF  [0603C]  (hidden comment: Cap)
C34  value 33nF  [0603C]  (hidden comment: Cap)
C35  value 2.2nF  [0603C]  (hidden comment: Cap)
C39  value 4.7pF  [0603C]  (hidden comment: Cap)
C41  value 18pF  [0603C]  (hidden comment: Cap)
C42  value 18pF  [0603C]  (hidden comment: Cap)
L2  value 3.9nH  [0603L]  (hidden comment: Inductor)
L3  value 8.2nH  [0603L]  (hidden comment: Inductor)
L4  value 5.6nH  [0603L]  (hidden comment: Inductor)
R21  value 22K  [0603R]  (hidden comment: Res3)
RXD  AN4  [TESTPOINT_TOP]  (value not drawn)
TXD  AN4  [TESTPOINT_TOP]  (value not drawn)
U2  nRF8001  [QFN50P500X500-32V5N]
Y3  value 16MHz  [TXC-16MHZ]  (hidden comment: TXC-16MHz)

### Ports
BT_CLK (in), BT_MISO (out), BT_MOSI (in), BT_RDYN (out), BT_REQN (in), BT_RESET (in), BT_SCK (in)

### Nets
GND: C28.1 C31.1 C32.2 C33.2 C34.2 C35.2 C39.2 C41.1 C42.2 R21.1 U2.8(VSS) U2.17(VSS) U2.18(VSS) U2.23(VSS) U2.30(VSS) U2.31(VSS) Y3.2 Y3.4
VCC: C28.2 C32.1 U2.1(VDD) U2.9(VDD) U2.24(AVDD) U2.26(AVDD) U2.29(AVDD)
ANT: ANT1.1 C29.2 C31.2
ANT1: L3.1 L4.1 U2.21(ANT1)
ANT2: L2.1 L3.2 U2.22(ANT2)
BT_IREF: R21.2 U2.25(IREF)
BT_RDYN: U2.16(RDYN) ; port BT_RDYN
BT_REQN: U2.12(REQN) ; port BT_REQN
DEC1: C33.1 U2.2(DEC1)
DEC2: C34.1 U2.3(DEC2)
PGC: U2.14(MISO) ; port BT_MISO
PGD: U2.13(MOSI) ; port BT_MOSI
RESET: U2.19(RESET) ; port BT_RESET
SCK: U2.11(SCK) ; port BT_SCK
VDD_PA: C35.1 C39.1 L4.2 U2.20(VDD_PA)
NetC29_1: C29.1 L2.2
NetC41_2: C41.2 U2.27(XC2) Y3.3
NetC42_1: C42.1 U2.28(XC1) Y3.1
NetRXD_1: RXD.1(TP) U2.10(RXD)
NetTXD_1: TXD.1(TP) U2.7(TXD)

Not connected (* = marked no-connect by the designer): U2 4(XL2) 5(XL1) 6(ACTIVE) 15(N/C) 32(DCC)

### Notes on the sheet
- 16MHz Reference Clock
- Keep length less than 1/10th of the wavelength
  2.4GHz -> 26cm wavelength -> max 26mm trace length
  Do not put any components or tracks underneath the antenna
  The PIC supplies a 16MHz clock signal.
  The clock must be accurate to 40ppm (+-640Hz) for the RF to operate correctly
  XL1/2 can use an internal RC oscillator
- OLED Watch - Bluetooth 4.0 LE
- R1
- Jared Sanson

### Library data of the parts
ANT1 = 2450AT18A100E: Manufacturer: JOHANSON TECHNOLOGY; Description: JOHANSON TECHNOLOGY - 2450AT18A100E - ANTENNA, CERAMIC, 2.45GHZ; Supplier 1: Farnell; Manufacturer Part Number: 2450AT18A100E; RoHS: Y-EX; Pricing 1: 1=1.63, 10=1.26, 100=1.03, 500=0.693, 3000=0.511 (NZD); ComponentLink1URL: http://www.farnell.com/datasheets/1318306.pdf; ComponentLink1Description: http://www.farnell.com/datasheets/1318306.pdf; ComponentLink2URL: http://www.farnell.com/datasheets/1318299.pdf; ComponentLink2Description: http://www.farnell.com/datasheets/1318299.pdf; ComponentLink3URL: http://www.johansontechnology.com/images/stories/ip/rf-antennas/Antenna_2450AT18A100.pdf; ComponentLink3Description: http://www.johansontechnology.com/images/stories/ip/rf-antennas/Antenna_2450AT18A100.pdf
C28 C29 C31-C35 C39 C41 C42 = Cap: Capacitor; Published: 8-Jun-2000; LatestRevisionDate: 17-Jul-2002; LatestRevisionNote: Re-released for DXP Platform.; PackageReference: RAD-0.3; Publisher: Altium Limited; PackageDescription: Radial Cap, Thru-Hole; 2 Leads; 0.3 in Pin Spacing
L2-L4 = Inductor: Code_IEC: 1005; Published: 8-Jun-2000; LatestRevisionDate: 29-May-2009; LatestRevisionNote: IPC-7351 Footprint Added.; PackageReference: 0402-A; Publisher: Altium Limited; PackageDescription: Chip Inductor; Code_JEITA: 0402
R21 = Res3: Resistor; Published: 8-Jun-2000; LatestRevisionDate: 29-May-2009; LatestRevisionNote: IPC-7351 Footprint Added.; PackageReference: J1-0603; Publisher: Altium Limited; PackageDescription: Chip Resistor
RXD TXD = TestPoint: Test Point; Comment_1: *
Y3 = CrystalTXC

## Nets that join several sheets
GND: cpu (27 pins), power (15 pins), oled (15 pins), sensors (10 pins), bluetoothle (18 pins)
VBAT: cpu (R1.1), power (6 pins)
VCC: cpu (20 pins), power (7 pins), oled (8 pins), sensors (11 pins), bluetoothle (7 pins)
AN_LIGHT: cpu (U1.14), sensors (C25.1 Q1.3 R5.1)
BT_RDYN: cpu (U1.23), bluetoothle (U2.16)
BT_REQN: cpu (U1.21), bluetoothle (U2.12)
D+: cpu (U1.37), power (J1.3)
D-: cpu (U1.36), power (J1.2)
INTA: cpu (U1.28), sensors (U5.8)
INTM: cpu (U1.27), sensors (U4.15)
OL_CS: cpu (U1.62), oled (OLED128x128.19)
OL_D0: cpu (U1.46), oled (OLED128x128.14)
OL_D1: cpu (U1.49), oled (OLED128x128.13)
OL_D2: cpu (U1.50), oled (OLED128x128.12)
OL_D3: cpu (U1.51), oled (OLED128x128.11)
OL_D4: cpu (U1.52), oled (OLED128x128.10)
OL_D5: cpu (U1.53), oled (OLED128x128.9)
OL_D6: cpu (U1.54), oled (OLED128x128.8)
OL_D7: cpu (U1.55), oled (OLED128x128.7)
OL_DC: cpu (U1.61), oled (OLED128x128.20)
OL_E: cpu (U1.64), oled (OLED128x128.15)
OL_RESET: cpu (U1.60), oled (OLED128x128.21)
OL_RW: cpu (U1.63), oled (OLED128x128.16)
OL_SHDN: cpu (U1.59), oled (U6.4)
PGC: cpu (TP19.1 U1.17), bluetoothle (U2.14)
PGD: cpu (TP20.1 U1.18), bluetoothle (U2.13)
PW_CE: cpu (U1.33), power (R19.2 U7.15)
RESET: cpu (U1.24), bluetoothle (U2.19)
SCK: cpu (U1.22), bluetoothle (U2.11)
SCL1: cpu (SCL.1 U1.32), sensors (U4.1 U5.14)
SDA1: cpu (SDA.1 U1.31), sensors (U4.16 U5.13)
STAT1: cpu (U1.4), power (R24.2 U7.7)
STAT2: cpu (U1.11), power (R22.2 U7.8)
VBUS: cpu (R2.2), power (C26.1 J1.1 U7.6 USB.1)

## Assembly variants
Default: all parts fitted
No Bluetooth: not fitted Q1 R5 U2